# EAGLE design zigtherm (EAGLE 7.5.0)
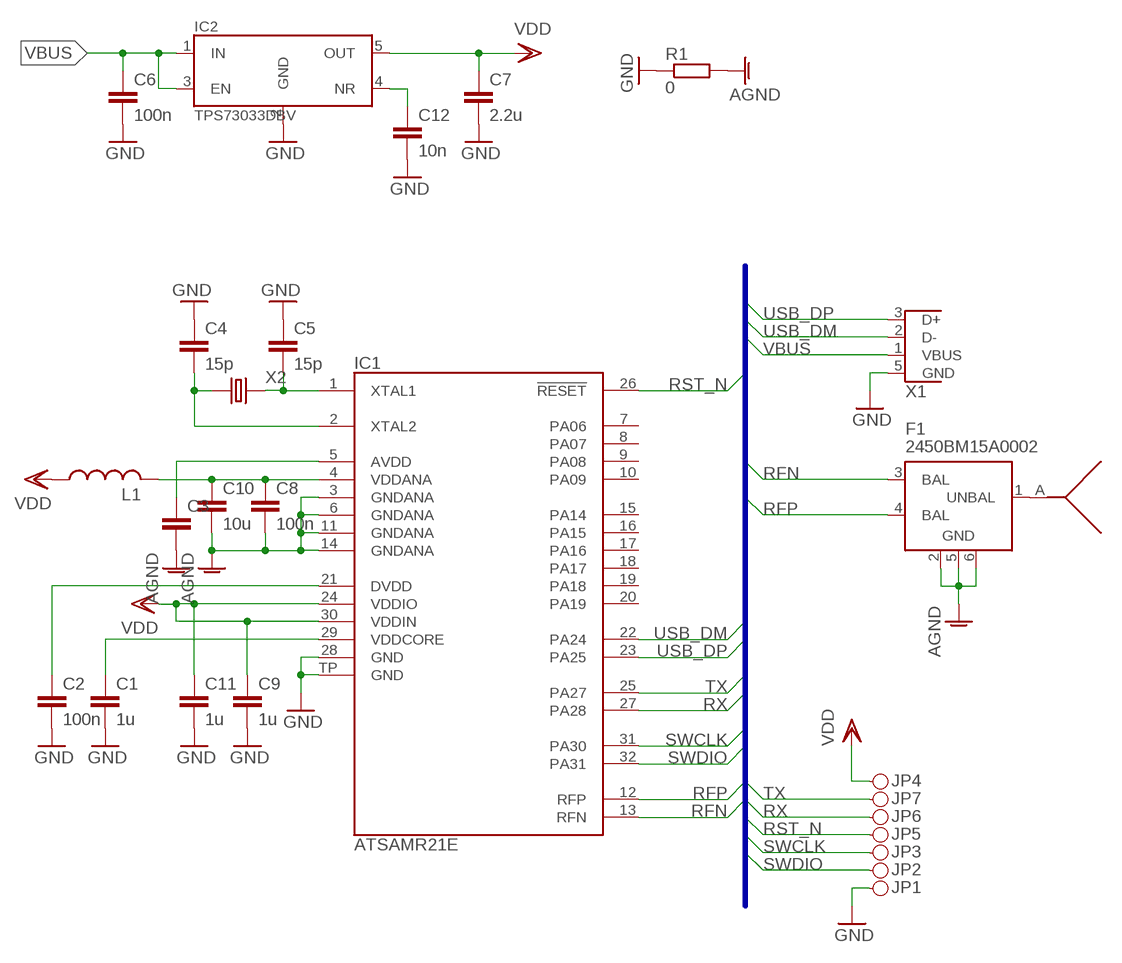
[diagram p0: schematic, sheet 1]

## Parts
AE1  INVERTED_F_ANTENNA  [INVERTED_F_ANTENNA]
C1  1u  C-EUC0603  [C0603]
C2  100n  C-EUC0603  [C0603]
C3  C-EUC0603  [C0603]
C4  15p  C-EUC0603  [C0603]
C5  15p  C-EUC0603  [C0603]
C6  100n  C-EUC0603  [C0603]
C7  2.2u  C-EUC0603  [C0603]
C8  100n  C-EUC0603  [C0603]
C9  1u  C-EUC0603  [C0603]
C10  10u  C-EUC0603  [C0603]
C11  1u  C-EUC0603  [C0603]
C12  10n  C-EUC0603  [C0603]
F1  2450BM15A0002  [2450BM15A0002]
IC1  ATSAMR21E  [QFN32]
IC2  TPS73033DBV  [SOT23-DBV]
JP1  PINH1X01SMD  [PINH1X01SMD]
JP2  PINH1X01SMD  [PINH1X01SMD]
JP3  PINH1X01SMD  [PINH1X01SMD]
JP4  PINH1X01SMD  [PINH1X01SMD]
JP5  PINH1X01SMD  [PINH1X01SMD]
JP6  PINH1X01SMD  [PINH1X01SMD]
JP7  PINH1X01SMD  [PINH1X01SMD]
L1  L-USL2012C  [L2012C]
R1  0  R-EU_R0603  [R0603]
X1  USB-MICRO-B-BOTTOM-MOLEX  [USB-MICRO-B-BOTTOM-MOLEX]
X2  XTAL3.2X2.5  [3.2X2.5]

## Nets
AGND: C3.2 C8.2 C10.2 F1.2(GND) F1.5(GND) F1.6(GND) IC1.3(GNDANA) IC1.6(GNDANA) IC1.11(GNDANA) IC1.14(GNDANA) R1.2
AVDD: C3.1 IC1.5(AVDD)
DVDD: C2.1 IC1.21(DVDD)
GND: C1.2 C2.2 C4.1 C5.1 C6.2 C7.2 C9.2 C11.2 C12.2 IC1.28(GND) IC1.TP(GND) IC2.2(GND) JP1.1 R1.1 X1.5(GND)
N$1: AE1.A F1.1(UNBAL)
N$2: C12.1 IC2.4(NR)
N$3: C4.2 IC1.2(XTAL2) X2.1
N$7: C5.2 IC1.1(XTAL1) X2.3
RFN: F1.3(BAL) IC1.13(RFN)
RFP: F1.4(BAL) IC1.12(RFP)
RST_N: IC1.26(!RESET) JP5.1
RX: IC1.27(PA28) JP6.1
SWCLK: IC1.31(PA30) JP3.1
SWDIO: IC1.32(PA31) JP2.1
TX: IC1.25(PA27) JP7.1
USB_DM: IC1.22(PA24) X1.2(D-)
USB_DP: IC1.23(PA25) X1.3(D+)
VBUS: C6.1 IC2.1(IN) IC2.3(EN) X1.1(VBUS)
VDD: C7.1 C9.1 C11.1 IC1.24(VDDIO) IC1.30(VDDIN) IC2.5(OUT) JP4.1 L1.1
VDDANA: C8.1 C10.1 IC1.4(VDDANA) L1.2
VDDCORE: C1.1 IC1.29(VDDCORE)
Unconnected: IC1.7(PA06) IC1.8(PA07) IC1.9(PA08) IC1.10(PA09) IC1.15(PA14) IC1.16(PA15) IC1.17(PA16) IC1.18(PA17) IC1.19(PA18) IC1.20(PA19)

## Buses
RST_N,SWCLK,SWDIO,VBUS,USB_DP,USB_DM,RFP,RFN,TX,RX

## Library data of the parts
AE1 = pcb_antennae:INVERTED_F_ANTENNA
C1-C12 = rcl:C-EU: CAPACITOR, European symbol
F1 = johanson-technology:2450BM15A0002: 2.45 GHz Impedance Matched Balun-Filter For TI CC253X/CC2540 Chipset family Data sheet <http://www.johansontechnology.com/images/stories/ip/baluns/balun_filter_combo_matched_2450bm15a0002_v8.pdf>
IC1 = zigtherm:ATSAMR21E
IC2 = tps73033:TPS73033
JP1-JP7 = pinhead_smd:PINH1X01
L1 = rcl:L-US: INDUCTOR, American symbol
R1 = rcl:R-EU_: RESISTOR, European symbol
X1 = usb:USB
X2 = xtal:XTAL

## Board
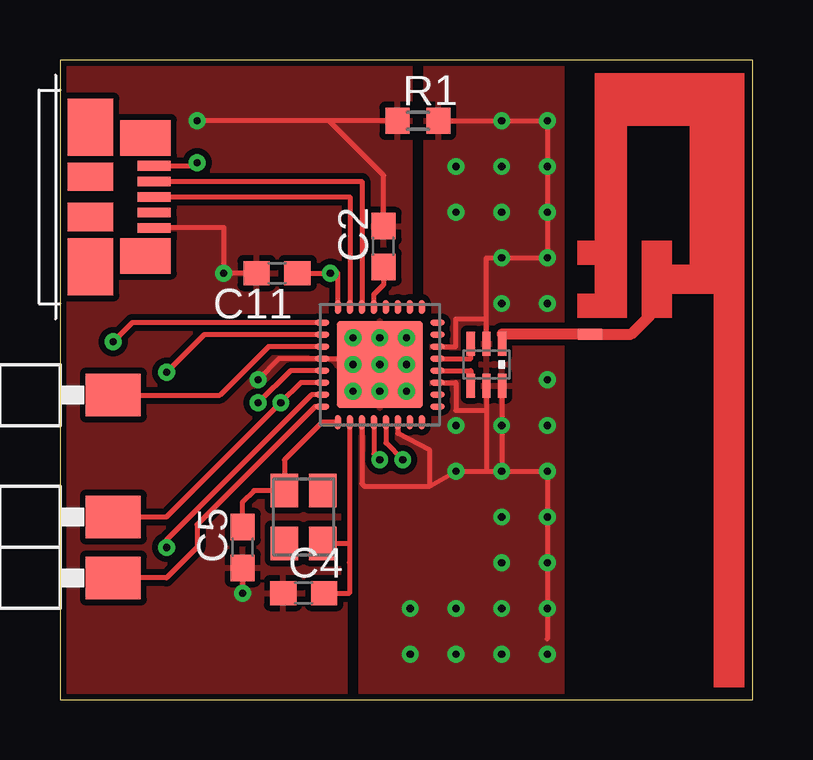
[diagram p1: board, top side]
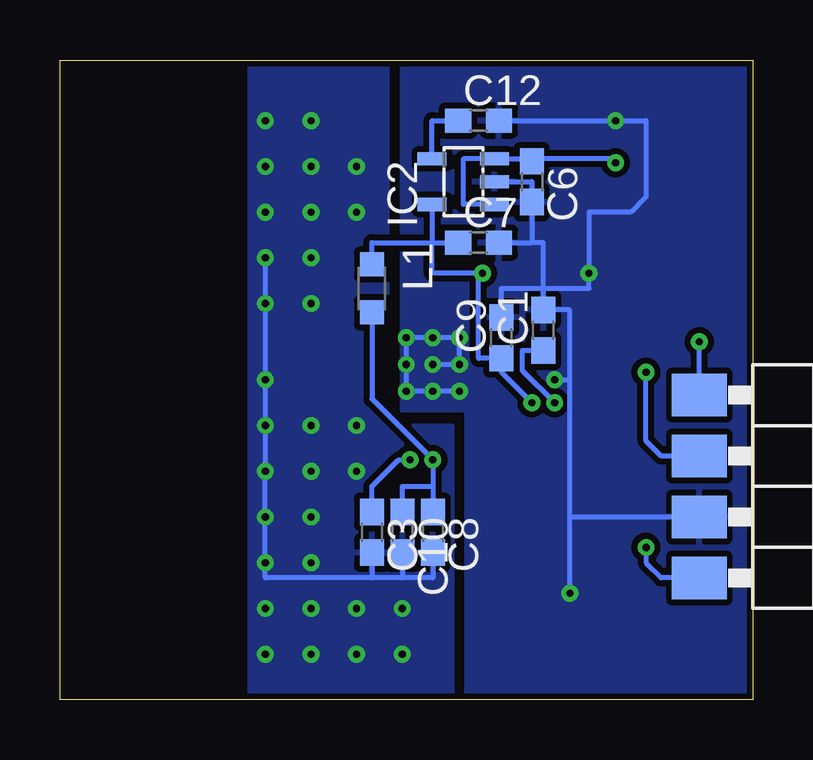
[diagram p2: board, bottom side, seen from below]

Size 28.88 x 26.66 mm. Coordinates in mm from the lower left corner, seen from the top.
Outline: 0,0 28.88,0 28.88,26.66 0,26.66 0,0
Copper layers (1*16): Top 0.035mm / dielectric 1.5mm / Bottom 0.035mm
Design rules "default *": minimum track width 0.15mm, minimum drill 0.3mm, track to track 0.15mm, track to pad 0.15mm, pad to pad 0.15mm, via to via 0.15mm, smd to smd 0.15mm, copper to edge 0.15mm, drill to drill 0.3mm, minimum pad ring 0.2mm, minimum via ring 0.2mm, stop-mask expansion 0.1mm, vias tented up to drill 0.3mm, thermal gap 10mil

### Footprints (pad centres in the part's own frame; a part is rotated, then mirrored left to right if it is on the bottom)
INVERTED_F_ANTENNA = smd 0.46 x 1: A 0,0.5
C0603 = smd 1.1 x 1: 1 -0.85,0; 2 0.85,0
2450BM15A0002 = smd 0.35 x 1: 1 -0.65,-0.875; 2 0,-0.875; 3 0.65,-0.875; 4 0.65,0.875; 5 0,0.875; 6 -0.65,0.875
QFN32 = smd 0.6 x 0.25: 1 -2.4,1.75; 2 -2.4,1.25; 3 -2.4,0.75; 4 -2.4,0.25; 5 -2.4,-0.25; 6 -2.4,-0.75; 7 -2.4,-1.25; 8 -2.4,-1.75; 17 2.4,-1.75; 18 2.4,-1.25; 19 2.4,-0.75; 20 2.4,-0.25; 21 2.4,0.25; 22 2.4,0.75; 23 2.4,1.25; 24 2.4,1.75 | smd 0.25 x 0.6: 9 -1.75,-2.4; 10 -1.25,-2.4; 11 -0.75,-2.4; 12 -0.25,-2.4; 13 0.25,-2.4; 14 0.75,-2.4; 15 1.25,-2.4; 16 1.75,-2.4; 25 1.75,2.4; 26 1.25,2.4; 27 0.75,2.4; 28 0.25,2.4; 29 -0.25,2.4; 30 -0.75,2.4; 31 -1.25,2.4; 32 -1.75,2.4 | smd 3.6 x 3.6: TP 0,0
SOT23-DBV = smd 0.55 x 1.2: 1 -0.95,-1.3; 2 0,-1.3; 3 0.95,-1.3; 4 0.95,1.3; 5 -0.95,1.3
PINH1X01SMD = smd 1.778 x 2.286: 1 0,-2.223
L2012C = smd 1 x 1: 1 -1,0; 2 1,0
R0603 = smd 1 x 1.1: 1 -0.85,0; 2 0.85,0
USB-MICRO-B-BOTTOM-MOLEX = smd 1.38 x 0.4: 1 3.93,1.3; 2 3.93,0.65; 3 3.93,0; 4 3.93,-0.65; 5 3.93,-1.3 | smd 1.9 x 2.375: S@1 1.27,2.913; S@4 1.27,-2.913 | smd 1.9 x 1.175: S@2 1.27,0.838; S@3 1.27,-0.838 | smd 2.1 x 1.475: S@5 3.57,2.462; S@6 3.57,-2.462
3.2X2.5 = smd 1.4 x 1.15: 1 1.1,0.8; 2 -1.1,0.8; 3 -1.1,-0.8; 4 1.1,-0.8

### Placement (x,y rotation side)
AE1  21.59,15.24 270 top
C1  8.73,15.4 90 bottom
C2  13.49,18.89 90 top
C3  15.88,6.99 270 bottom
C4  10.16,4.45 0 top
C5  7.62,6.35 90 top
C6  9.21,21.59 270 bottom
C7  11.43,19.05 0 bottom
C8  13.34,6.99 270 bottom
C9  10.48,15.08 90 bottom
C10  14.61,6.99 270 bottom
C11  9.05,17.78 180 top
C12  11.43,24.13 0 bottom
F1  17.78,13.97 180 top
IC1  13.34,13.97 90 top
IC2  12.06,21.59 90 bottom
JP1  0,7.62 270 bottom
JP2  0,5.08 90 top
JP3  0,5.08 270 bottom
JP4  0,7.62 90 top
JP5  0,10.16 270 bottom
JP6  0,12.7 90 top
JP7  0,12.7 270 bottom
L1  15.88,17.14 270 bottom
R1  14.92,24.13 0 top
X1  0,20.95 0 top
X2  10.16,7.62 270 top

### Tracks (layer width: path | path; a pad name or v marks a point on that pad's centre or on a via)
AGND  (via drill 0.3)
  Top 0.2: R1.2 v18.41,24.13 v20.32,24.13 v20.32,22.23 v20.32,20.32 v20.32,18.41 v18.41,18.41 17.78,18.41 17.78,15.88 | 20.32,2.54 v20.32,3.81 v20.32,5.71 v20.32,7.62 v20.32,9.53 18.43,9.53 | F1.2 17.78,15.88 | F1.5 17.78,12.06 | 17.78,12.06 17.78,9.53 | 17.78,9.53 v18.41,9.53 18.43,9.53 | F1.6 18.43,9.53 | IC1.11 16.51,13.22 16.51,12.06 17.78,12.06 | IC1.14 16.51,14.72 16.51,15.88 17.78,15.88 | IC1.6 14.09,11.1 15.4,10.42 15.4,8.89 | IC1.3 12.59,9.01 12.7,8.89 15.4,8.89 | 15.4,8.89 v16.51,9.53 17.78,9.53
  Bottom 0.2: C8.2 13.34,5.08 14.61,5.08 | C10.2 14.61,5.08 | 14.61,5.08 15.88,5.08 | 15.88,5.08 20.32,5.08 v20.32,5.71 v20.32,7.62 v20.32,9.53 v20.32,11.43 v20.32,13.34 v20.32,16.51 v20.32,18.41 | C3.2 15.88,5.08
  other vias: 16.51,22.23 16.51,20.32 18.41,20.32 18.41,22.23 18.41,16.51 14.61,3.81 14.61,1.91 16.51,3.81 16.51,1.91 18.41,1.91 18.41,3.81 18.41,5.71 18.41,7.62 18.41,11.43 16.51,11.43 20.32,1.91
  pour Bottom (isolate 0.254): 20.95,26.67 15.24,26.67 15.24,11.43 12.54,11.43 12.54,0 20.95,0
  pour Top (isolate 0.254): 20.95,26.67 15.24,26.67 15.24,11.43 12.54,11.43 12.54,0 20.95,0
AVDD  (via drill 0.3)
  Top 0.2: IC1.5 13.59,10.7 v14.29,10
  Bottom 0.2: C3.1 15.88,8.89 14.76,10 v14.29,10
DVDD
  Top 0.2: IC1.21 13.09,16.89 13.49,17.3 C2.1
GND  (via drill 0.3)
  Top 0.2: IC1.TP 13.09,14.22 IC1.28 9.12,14.22 v8.26,13.34 | C2.2 13.49,21.85 11.21,24.13 | 11.21,24.13 v5.71,24.13 | R1.1 11.21,24.13 | C5.1 v7.62,4.45 | X1.5 3.93,19.68 6.83,19.68 v6.83,17.78 C11.2
  Bottom 0.2: C7.2 9.21,19.05 | IC2.2 9.21,21.59 C6.2 9.21,19.05 | C12.2 v5.71,24.13 4.45,24.13 4.45,20.95 5.08,20.32 6.83,20.32 v6.83,17.78 6.83,17.14 8.73,17.14 | v12.22,12.86 v13.34,12.86 v14.45,12.86 v14.45,13.97 v14.45,15.08 v13.34,15.08 v12.22,15.08 v12.22,13.97 IC1.TP | 8.73,17.14 C1.2 7.62,16.25 7.62,13.34 | 8.73,17.14 8.73,19.05 9.21,19.05 | v8.26,13.34 7.62,13.34 | 7.62,7.62 JP1.1 | v7.62,4.45 7.62,7.62 | 7.62,7.62 7.62,13.34 | C9.2 10.48,17.14 8.73,17.14
  other vias: 13.34,13.97
  pour Top (isolate 0.254): 14.61,26.67 0,26.67 0,0 11.91,0 11.91,12.06 14.61,12.06
  pour Bottom (isolate 0.254): 14.61,26.67 0,26.67 0,0 11.91,0 11.91,12.06 14.61,12.06
N$1
  Top 0.2: 18.43,15.24 F1.1
  Top 0.46: AE1.A 18.43,15.24
N$2
  Bottom 0.2: IC2.4 13.37,24.13 C12.1
N$3
  Top 0.2: IC1.2 12.06,11.55 12.06,6.52 | C4.2 12.06,4.45 12.06,5.71 12.06,6.52 | X2.1 12.06,6.52
N$7
  Top 0.2: IC1.1 10.94,11.57 9.36,9.99 X2.3 8.09,8.72 7.62,8.26 C5.2
RFN
  Top 0.2: IC1.13 17.13,14.22 F1.3
RFP
  Top 0.2: IC1.12 17.13,13.72 F1.4
RST_N  (via drill 0.3)
  Top 0.2: IC1.26 6.01,15.22 v4.45,13.65
  Bottom 0.2: JP5.1 3.81,10.16 4.45,10.79 4.45,13.34 v4.45,13.65
RX
  Top 0.2: IC1.27 8.69,14.72 6.67,12.7 JP6.1
SWCLK  (via drill 0.3)
  Top 0.2: IC1.31 10.5,12.72 4.45,6.67 v4.45,6.35
  Bottom 0.2: JP3.1 3.81,5.08 4.45,5.71 v4.45,6.35
SWDIO
  Top 0.2: IC1.32 10.63,12.22 5.71,7.3 5.71,6.35 4.45,5.08 JP2.1
TX  (via drill 0.3)
  Top 0.2: IC1.25 3.02,15.72 v2.22,14.92
  Bottom 0.2: JP7.1 v2.22,14.92
USB_DM
  Top 0.2: X1.2 12.59,21.61 IC1.22
USB_DP
  Top 0.2: X1.3 12.09,20.95 IC1.23
VBUS  (via drill 0.3)
  Top 0.2: X1.1 5.59,22.25 v5.71,22.38
  Bottom 0.2: v5.71,22.38 5.87,22.54 9.21,22.54 | IC2.1 12.06,20.64 12.06,22.54 IC2.3 9.21,22.54 | 9.21,22.54 C6.1
VDD  (via drill 0.3)
  Top 0.2: IC1.30 10.04,13.22 v9.21,12.38 4.45,7.62 JP4.1 | IC1.24 11.59,17.78 v11.27,17.78 C11.1
  Bottom 0.2: IC2.5 13.37,19.05 | 13.37,19.05 C7.1 15.88,19.05 L1.1 | 11.43,17.78 13.37,17.78 13.37,19.05 | v9.21,12.38 10.48,13.65 C9.1 11.43,14.23 11.43,17.78 | 11.43,17.78 v11.27,17.78
VDDANA  (via drill 0.3)
  Top 0.2: IC1.4 13.09,10.25 v13.34,10
  Bottom 0.2: 13.34,8.89 v13.34,10 15.88,12.54 L1.2 | 13.34,8.89 C8.1 | C10.1 14.61,8.89 13.34,8.89
VDDCORE  (via drill 0.3)
  Top 0.2: IC1.29 9.62,13.72 v8.26,12.38
  Bottom 0.2: C1.1 9.62,14.55 9.62,13.72 9.59,13.72 v8.26,12.38